# Altium schematic sheet Audio_Codec.SchDoc: Audio CODEC
size A4; DocumentNumber: 4; SheetNumber: 6; SheetTotal: 78
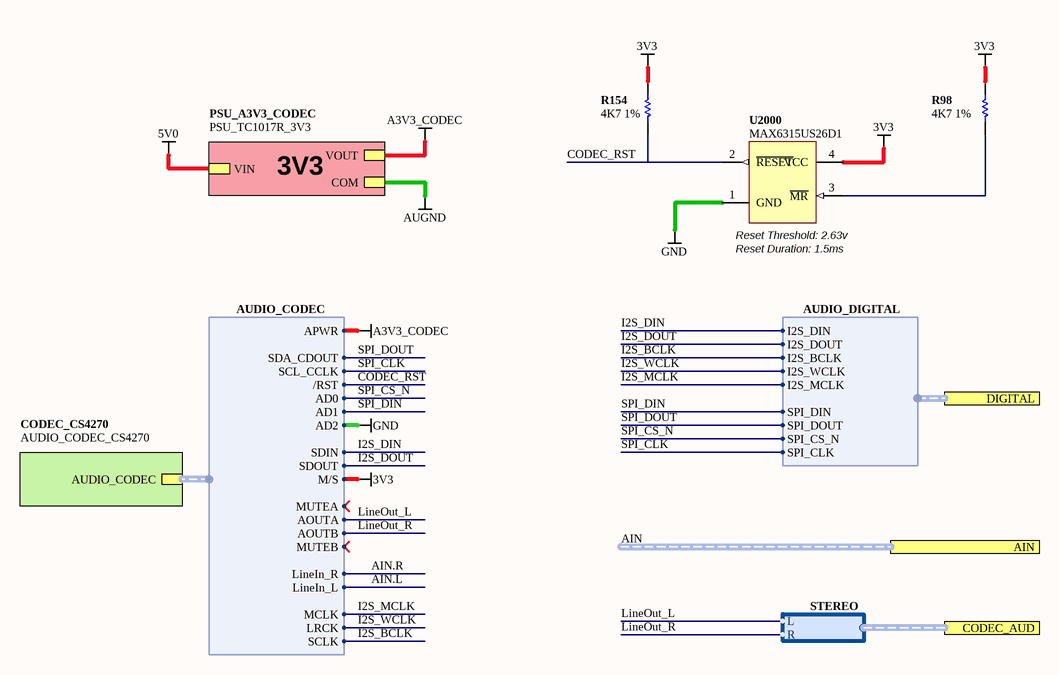
[diagram p0: Audio_Codec.SchDoc]

## Parts
R98  4K7 1%  [RESC1005-STAR]
R154  4K7 1%  [RESC1005-STAR]
U2000  MAX6315US26D1  [SOT143]

## Sub-sheets
CODEC_CS4270 = AUDIO_CODEC_CS4270: AUDIO_CODEC (harness AUDIO_CODEC)
PSU_A3V3_CODEC = PSU_TC1017R_3V3: VIN, VOUT, COM

## Ports
AIN (harness AUDIO_IN), CODEC_AUD (harness STEREO), DIGITAL (harness AUDIO_DIGITAL)

## Harnesses
AUDIO_CODEC: SDOUT, SDIN, SCLK, LRCK, MCLK, M/S, LineIn_L, LineIn_R, AOUTA, AOUTB, APWR, SCL_CCLK, AD1, SDA_CDOUT, AD0, AD2, /RST, MUTEA, MUTEB
AUDIO_DIGITAL: I2S_DOUT, I2S_DIN, I2S_BCLK, I2S_WCLK, I2S_MCLK, SPI_CLK, SPI_DIN, SPI_DOUT, SPI_CS_N
STEREO: L, R

## Nets
3V3: R98.2 R154.2 U2000.4(VCC) ; sheet CODEC_CS4270/AUDIO_CODEC.M/S
5V0: sheet PSU_A3V3_CODEC/VIN
A3V3_CODEC: sheet PSU_A3V3_CODEC/VOUT, sheet CODEC_CS4270/AUDIO_CODEC.APWR
AUGND: sheet PSU_A3V3_CODEC/COM
GND: U2000.1(GND) ; sheet CODEC_CS4270/AUDIO_CODEC.AD2
AIN.L: sheet CODEC_CS4270/AUDIO_CODEC.LineIn_L
AIN.R: sheet CODEC_CS4270/AUDIO_CODEC.LineIn_R
CODEC_RST: R154.1 U2000.2(~{RESET}) ; sheet CODEC_CS4270/AUDIO_CODEC./RST
I2S_BCLK: sheet CODEC_CS4270/AUDIO_CODEC.SCLK, port DIGITAL.I2S_BCLK
I2S_DIN: sheet CODEC_CS4270/AUDIO_CODEC.SDIN, port DIGITAL.I2S_DIN
I2S_DOUT: sheet CODEC_CS4270/AUDIO_CODEC.SDOUT, port DIGITAL.I2S_DOUT
I2S_MCLK: sheet CODEC_CS4270/AUDIO_CODEC.MCLK, port DIGITAL.I2S_MCLK
I2S_WCLK: sheet CODEC_CS4270/AUDIO_CODEC.LRCK, port DIGITAL.I2S_WCLK
LineOut_L: sheet CODEC_CS4270/AUDIO_CODEC.AOUTA, port CODEC_AUD.L
LineOut_R: sheet CODEC_CS4270/AUDIO_CODEC.AOUTB, port CODEC_AUD.R
SPI_CLK: sheet CODEC_CS4270/AUDIO_CODEC.SCL_CCLK, port DIGITAL.SPI_CLK
SPI_CS_N: sheet CODEC_CS4270/AUDIO_CODEC.AD0, port DIGITAL.SPI_CS_N
SPI_DIN: sheet CODEC_CS4270/AUDIO_CODEC.AD1, port DIGITAL.SPI_DIN
SPI_DOUT: sheet CODEC_CS4270/AUDIO_CODEC.SDA_CDOUT, port DIGITAL.SPI_DOUT
NetR98_1: R98.1 U2000.3(~{MR})

## Buses and harness runs
harness AIN = port AIN

## Notes on the sheet
- 3V3
- (near U2000) Reset Threshold: 2.63v
- (near U2000) Reset Duration: 1.5ms
- Sheet Title
- Project Title
- Size:
- Date:
- A4
- Assy:
- Time:
- Revision:
- Sheet
- of
- File:

## Library data of the parts
R98 R154 = D-100-0088: Resistor, 4K7 1% 0402 (1005); Power Rating: 63 mW; Resistance: 4.7 K; Category: Resistor; Mounting Technology: Surface Mount; Status: Production; Tolerance: 1 %
U2000 = D-243-0000: MAX6315, Open-Drain Output SOT Reset IC, Customized Reset Thresholds, Timeout Delays; Category: IC-Other; Status: Production